# Altium schematic sheet obc-v2_COVER-PAGE.SchDoc
size 420 x 297 mm; SheetNumber: 1; SheetTotal: 23
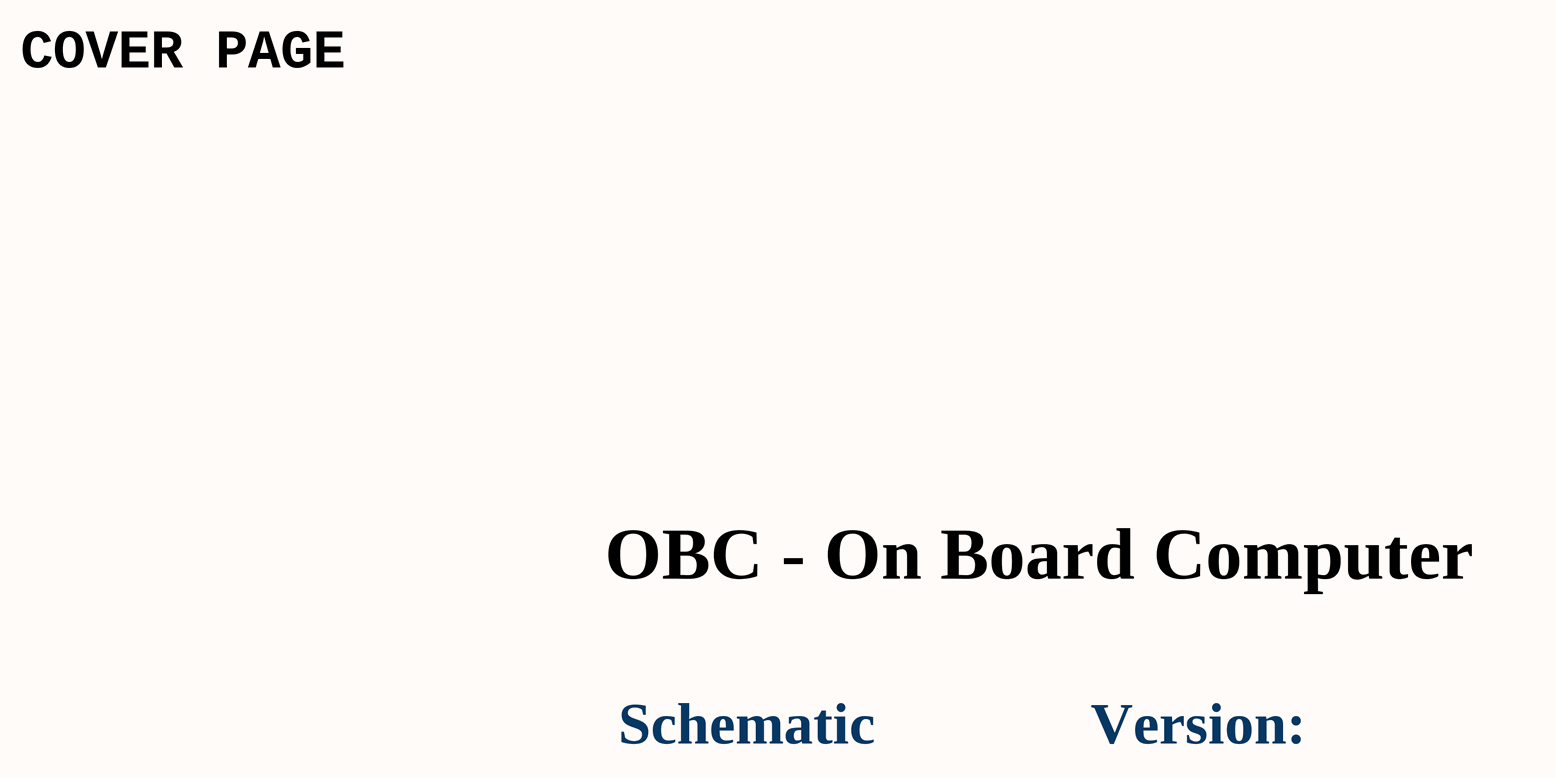
[diagram p0: obc-v2_COVER-PAGE.SchDoc]

## Notes on the sheet
- COVER PAGE
- OBC - On Board Computer
- Schematic
- Version:
- Project:
- Sub-system:
- Design by:
- Sheet title:
- Sheet
- A3
- of
- Checked by:
- Approved by:
- Revision:
- Document No:
- Size:
- Date: